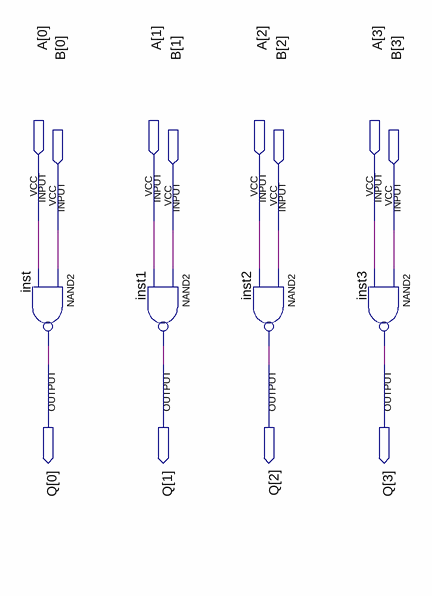
[diagram p0: schematic sheet]
// Quartus schematic NAND_4BIT.bdf as structural Verilog: 4 symbols, 12 pins
module NAND_4BIT (
  input  [3:0] A,
  input  [3:0] B,
  output [3:0] Q
);

  nand inst (Q[0], B[0], A[0]);
  nand inst1 (Q[1], B[1], A[1]);
  nand inst2 (Q[2], B[2], A[2]);
  nand inst3 (Q[3], B[3], A[3]);
endmodule
